# EAGLE design logic 7408.v1.1 (EAGLE 7.1.0)
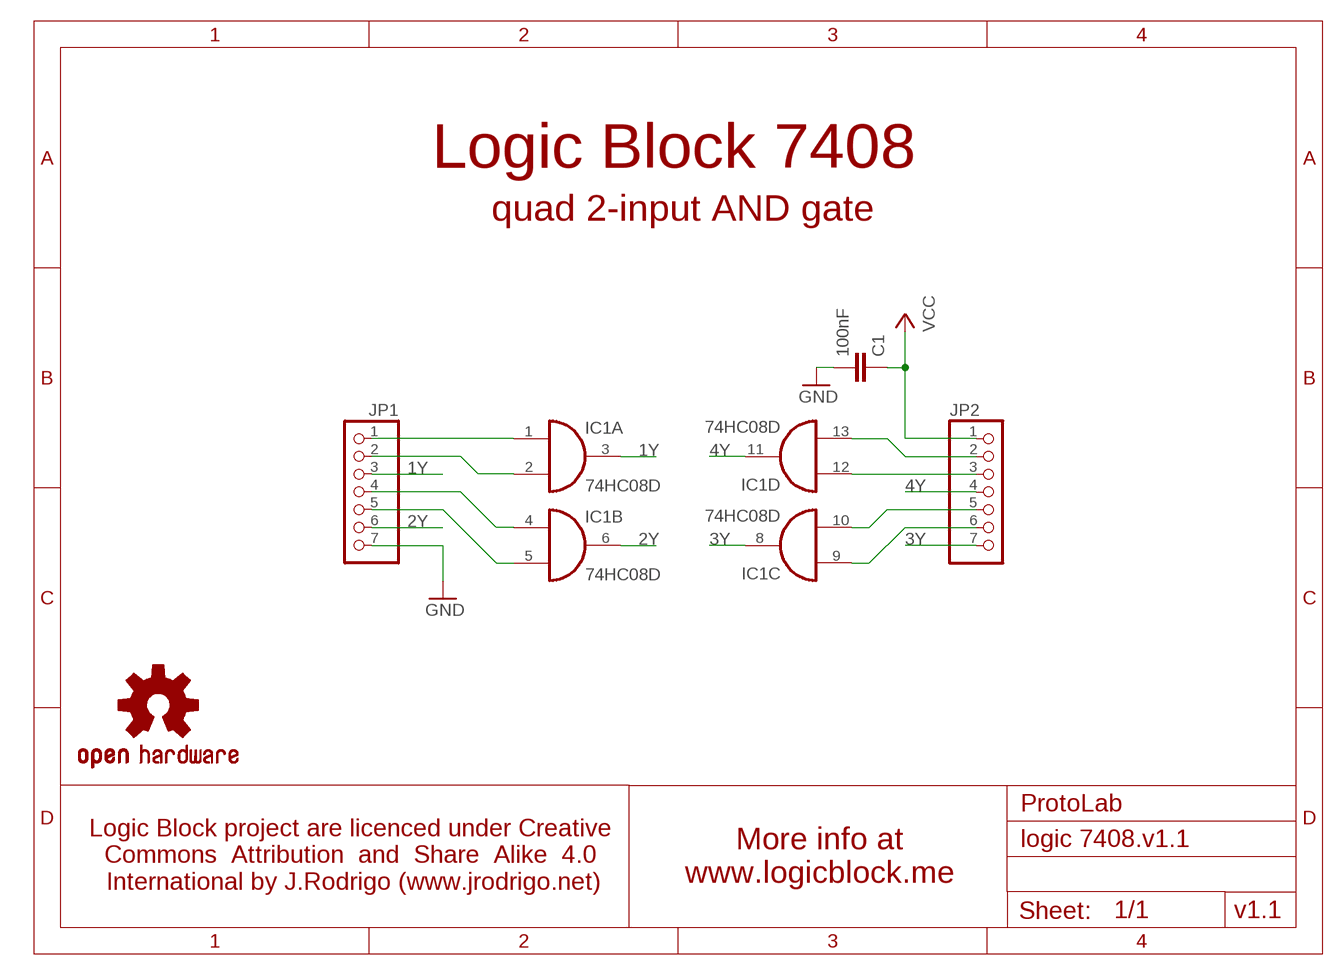
[diagram p0: schematic, sheet 1]

## Parts
C1  100nF  C-EUC0805K  [C0805K]
IC1  74HC08D  [SO14]
JP1  CON_1X7CLEANBIG  [CON_1X07-CLEANBIG]
JP2  CON_1X7CLEANBIG  [CON_1X07-CLEANBIG]
U$1  OSHW-LOGOS-LAYER230  [OSHW-LOGO-S_LAYER230]

## Nets
1Y: IC1.3(A:O) JP1.3
2Y: IC1.6(B:O) JP1.6
3Y: IC1.8(C:O) JP2.7
4Y: IC1.11(D:O) JP2.4
GND: C1.2 JP1.7
N$1: IC1.1(A:I0) JP1.1
N$2: IC1.2(A:I1) JP1.2
N$4: IC1.9(C:I0) JP2.6
N$5: IC1.4(B:I0) JP1.4
N$6: IC1.5(B:I1) JP1.5
N$7: IC1.10(C:I1) JP2.5
N$9: IC1.12(D:I0) JP2.3
N$10: IC1.13(D:I1) JP2.2
VCC: C1.1 JP2.1

## Notes on the sheet
- Logic Block 7408
- quad 2-input AND gate
- ProtoLab
- More info at
  www.logicblock.me
- Logic Block project are licenced under Creative 
  Commons  Attribution  and  Share  Alike  4.0 
  International by J.Rodrigo (www.jrodrigo.net)
- v1.1

## Power pins joined to a net without a drawn wire
GND: IC1.7(P:GND)
VCC: IC1.14(P:VCC)

## Library data of the parts
C1 = rcl:C-EU: CAPACITOR, European symbol
IC1 = 74xx-eu:74*08: Quad 2-input AND gate
JP1 JP2 = Ardublog:CON_1X7: PIN HEADER
U$1 = logicblock:OSHW-LOGO: Open Source Hardware Logo This logo indicates the piece of hardware it is found on incorporates a OSHW license and/or adheres to the definition of open source hardware found here: http://freedomdefined.org/OSHW

## Board
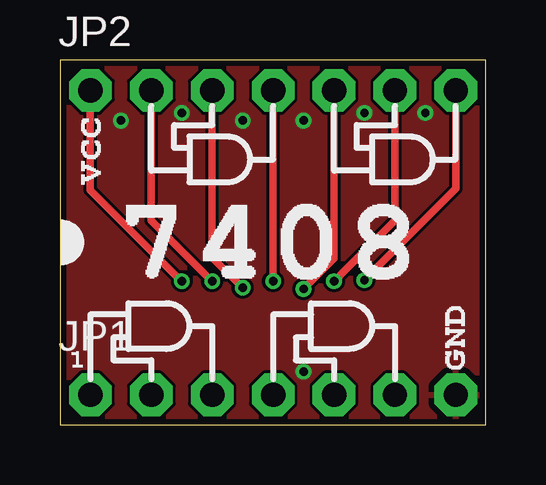
[diagram p1: board, top side]
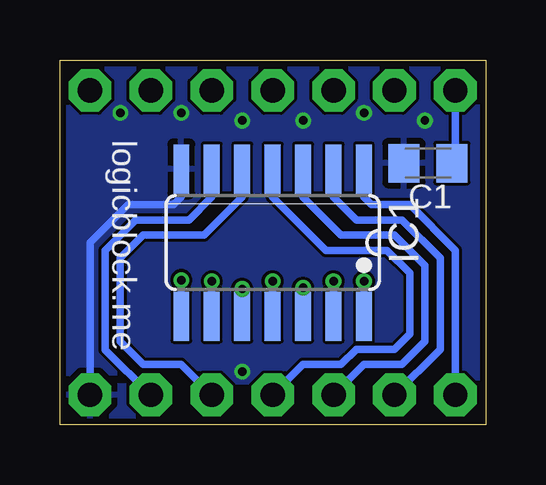
[diagram p2: board, bottom side, seen from below]

Size 17.76 x 15.23 mm. Coordinates in mm from the lower left corner, seen from the top.
Outline: 0,0 17.76,0 17.76,15.23 0,15.23 0,0
Copper layers (1*16): Top 0.035mm / dielectric 1.5mm / Bottom 0.035mm
Design rules "dirt_cheap_dirty_boards.v1": minimum track width 5mil, minimum drill 12mil, track to track 5mil, track to pad 5mil, pad to pad 5mil, via to via 5mil, smd to smd 0mil, copper to edge 10mil, drill to drill 10mil, minimum pad ring 10mil, minimum via ring 6mil, stop-mask expansion 2mil, vias tented up to drill 25mil, thermal gap 10mil
bRestrict: 5 lines

### Footprints (pad centres in the part's own frame; a part is rotated, then mirrored left to right if it is on the bottom)
C0805K = smd 1.3 x 1.6: 1 -1,0; 2 1,0
SO14 = smd 0.66 x 2.032: 1 -3.81,-3.073; 2 -2.54,-3.073; 3 -1.27,-3.073; 4 0,-3.073; 5 1.27,-3.073; 6 2.54,-3.073; 7 3.81,-3.073; 8 3.81,3.073; 9 2.54,3.073; 10 1.27,3.073; 11 0,3.073; 12 -1.27,3.073; 13 -2.54,3.073; 14 -3.81,3.073
CON_1X07-CLEANBIG = drill 1.016 pad 1.778 octagon: 1 -8.89,0; 2 -6.35,0; 3 -3.81,0; 4 -1.27,0; 5 1.27,0; 6 3.81,0; 7 6.35,0

### Placement (x,y rotation side)
C1  2.41,10.92 180 bottom
IC1  8.89,7.61 180 bottom
JP1  10.16,1.26 0 top
JP2  10.16,13.96 0 top
U$1  2.54,5.71 90 top

### Tracks (layer width: path | path; a pad name or v marks a point on that pad's centre or on a via)
1Y
  Bottom 0.305: JP1.3 5.08,2.53 3.49,2.53 2.54,3.48 2.54,6.66 3.81,7.92 6.03,7.92 7.62,9.51 IC1.3
2Y
  Bottom 0.305: JP1.6 15.88,3.14 15.88,7.29 14.61,8.56 12.38,8.56 11.43,9.51 IC1.6
3Y  (via drill 0.35)
  Top 0.305: v12.7,6.04 16.51,9.86 JP2.7
  Bottom 0.305: v12.7,6.04 IC1.8
4Y  (via drill 0.35)
  Top 0.305: JP2.4 v8.89,5.99
  Bottom 0.305: v8.89,5.99 IC1.11
GND  (via drill 0.35)
  Bottom 0.305: JP1.7 16.51,7.61 14.92,9.2 13.02,9.2 12.7,9.51 IC1.7
  other vias: 15.24,13.02 12.7,13.02 2.54,12.7 5.08,13.02 10.16,12.7 7.62,12.7 10.16,2.22
  pour Top: 0,0 0,15.24 17.78,15.24 17.78,0
  pour Bottom: 0,0 0,15.24 17.78,15.24 17.78,0
N$1
  Bottom 0.305: JP1.1 1.27,7.29 3.17,9.2 4.76,9.2 5.08,9.51 IC1.1
N$2
  Bottom 0.305: JP1.2 1.91,3.16 1.91,6.97 3.49,8.56 5.4,8.56 6.35,9.51 IC1.2
N$4  (via drill 0.35)
  Top 0.305: v11.43,5.99 13.97,8.53 JP2.6
  Bottom 0.305: v11.43,5.99 IC1.9
N$5
  Bottom 0.305: JP1.4 7.62,2.53 6.03,2.53 5.4,3.16 3.81,3.16 3.17,3.8 3.17,6.34 4.13,7.29 6.67,7.29 8.89,9.51 IC1.4
N$6
  Bottom 0.305: JP1.5 12.7,2.53 14.29,2.53 15.24,3.48 15.24,6.97 14.29,7.92 11.75,7.92 10.16,9.51 IC1.5
N$7  (via drill 0.35)
  Top 0.305: v10.16,5.68 11.43,6.95 JP2.5
  Bottom 0.305: v10.16,5.68 IC1.10
N$9  (via drill 0.35)
  Top 0.305: v7.62,5.73 6.35,7 JP2.3
  Bottom 0.305: v7.62,5.73 IC1.12
N$10  (via drill 0.35)
  Top 0.305: v6.35,5.99 3.81,8.53 JP2.2
  Bottom 0.305: v6.35,5.99 IC1.13
VCC  (via drill 0.35)
  Top 0.305: v5.08,5.99 1.27,9.8 JP2.1
  Bottom 0.305: v5.08,5.99 IC1.14 | C1.1 1.27,10.92 JP2.1

### Text on the board
bsilkscreen: logicblock.me